# EAGLE design USBPowerBoost_SMD_v0_1_6 (EAGLE 5.11)
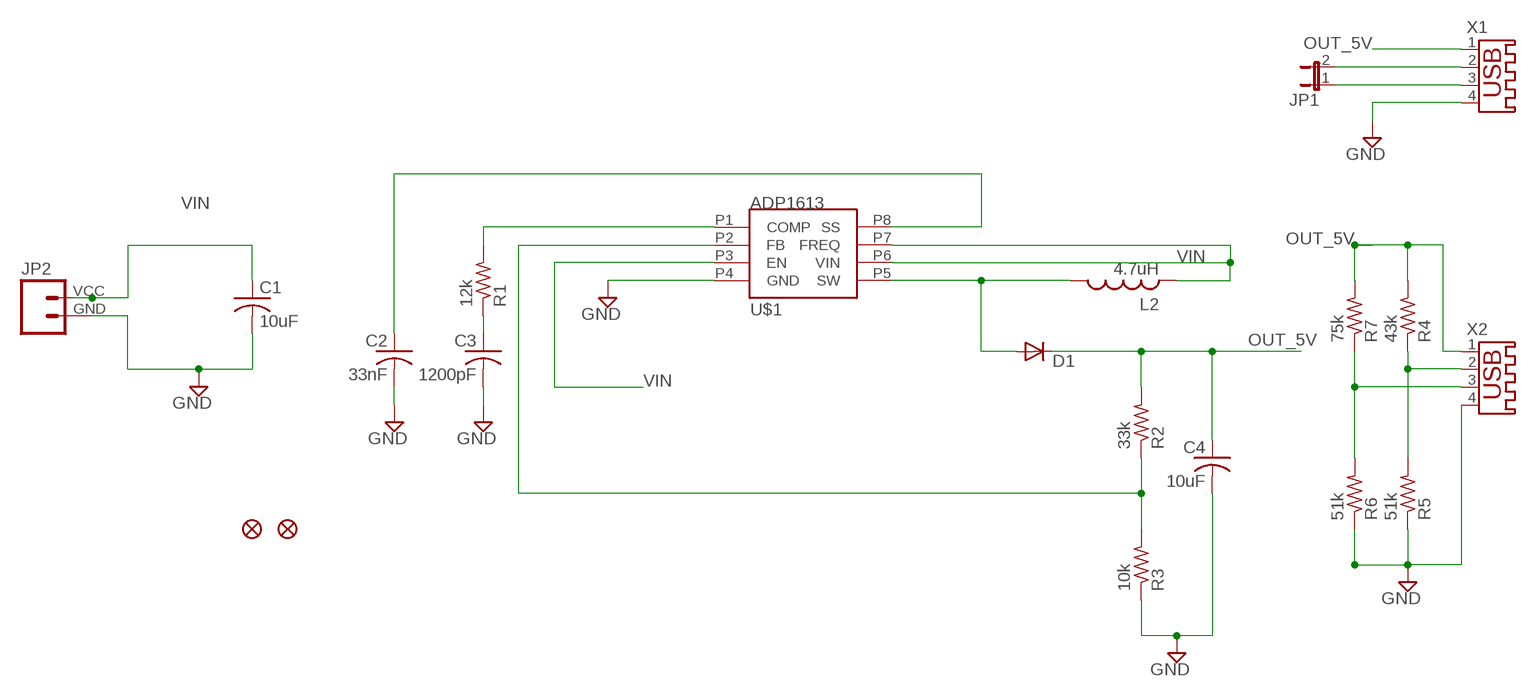
[diagram p0: schematic, sheet 1]

## Parts
C1  10uF  C-USC1206  [C1206]
C2  33nF  C-USC0603  [C0603]
C3  1200pF  C-USC0603  [C0603]
C4  10uF  C-USC1206  [C1206]
D1  DIODE-DO-214AC  [DO-214AC]
FIDUCIAL1  FIDUCIAL1X2  [FIDUCIAL-1X2]
FIDUCIAL2  FIDUCIAL1X2  [FIDUCIAL-1X2]
JP1  JUMPER-2PTH  [1X02]
JP2  M024UCON-15767  [JST-2-SMD-VERT]
L2  4.7uH  L-VLC5045  [VLC5045]
R1  12k  R-US_R0603  [R0603]
R2  33k  R-US_R0603  [R0603]
R3  10k  R-US_R0603  [R0603]
R4  43k  R-US_R0603  [R0603]
R5  51k  R-US_R0603  [R0603]
R6  51k  R-US_R0603  [R0603]
R7  75k  R-US_R0603  [R0603]
U$1  ADP1613  [RM-8]
X1  USB-A003  [USB-A003]
X2  USB-A003  [USB-A003]

## Nets
5V: D1.A L2.P$2 U$1.P5(SW)
GND: C1.2 C2.2 C3.2 C4.2 JP2.GND R3.1 R5.1 R6.1 U$1.P4(GND) X1.4 X2.4
N$2: R2.1 R3.2 U$1.P2(FB)
N$3: R4.1 R5.2 X2.2
N$5: R1.2 U$1.P1(COMP)
N$7: C3.1 R1.1
N$8: JP1.2 X1.2
N$9: JP1.1 X1.3
N$11: C2.1 U$1.P8(SS)
N$15: R6.2 R7.1 X2.3
OUT_5V: C4.1 D1.C R2.2 R4.2 R7.2 X1.1 X2.1
VIN: C1.1 JP2.VCC L2.P$1 U$1.P3(EN) U$1.P6(VIN) U$1.P7(FREQ)

## Library data of the parts
C1-C4 = rcl:C-US: CAPACITOR, American symbol
D1 = diode:DIODE-: DIODE
FIDUCIAL1 FIDUCIAL2 = SparkFun:FIDUCIAL: Fiducial Alignment Points Various fiducial points for machine vision alignment.
JP1 = SparkFun:JUMPER-2: Jumper Basic 0.1" spaced jumper. Use with breakaway headers.
JP2 = SparkFun:M02: Header 2 Standard 2-pin 0.1" header. Use with straight break away headers (SKU : PRT-00116), right angle break away headers (PRT-00553), swiss pins (PRT-00743), machine pins (PRT-00117), and female headers (PRT-00115). Molex polarized connector foot print use with SKU : PRT-08233 with associated crimp pins and housings.
L2 = bootstrapsolar:L-VLC5045: VLC5045 Series inductor. SMD.
R1-R7 = resistor:R-US_: RESISTOR, American symbol
U$1 = adp1613:ADP1613
X1 X2 = con-yamaichi:USB-A003: USB connector; OC_FARNELL: unknown; OC_NEWARK: unknown

## Board
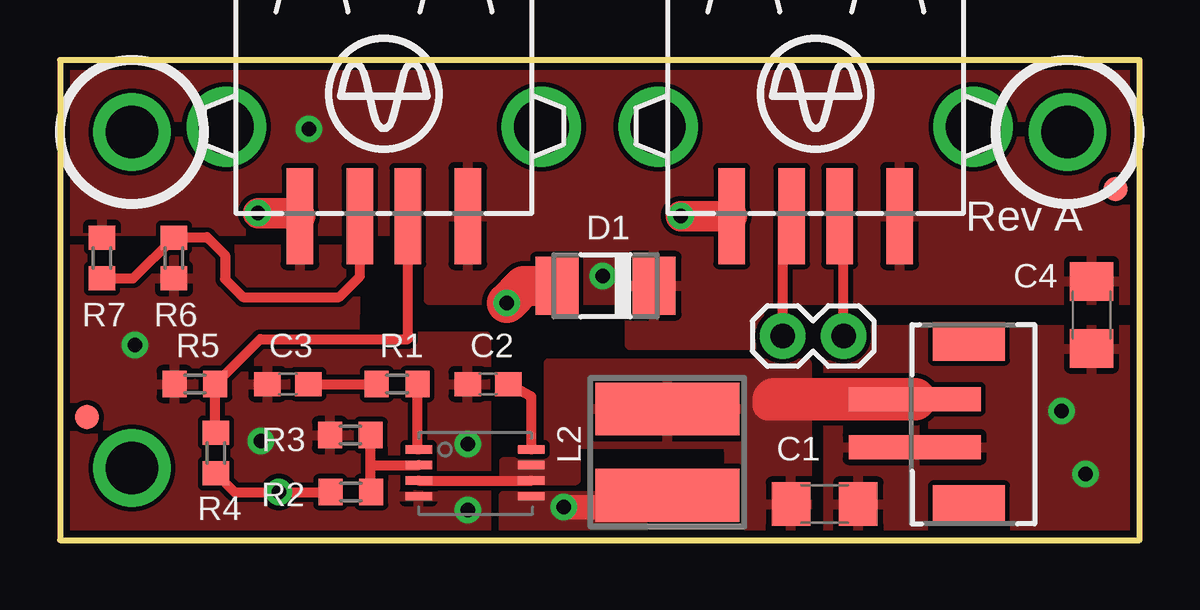
[diagram p1: board, top side]
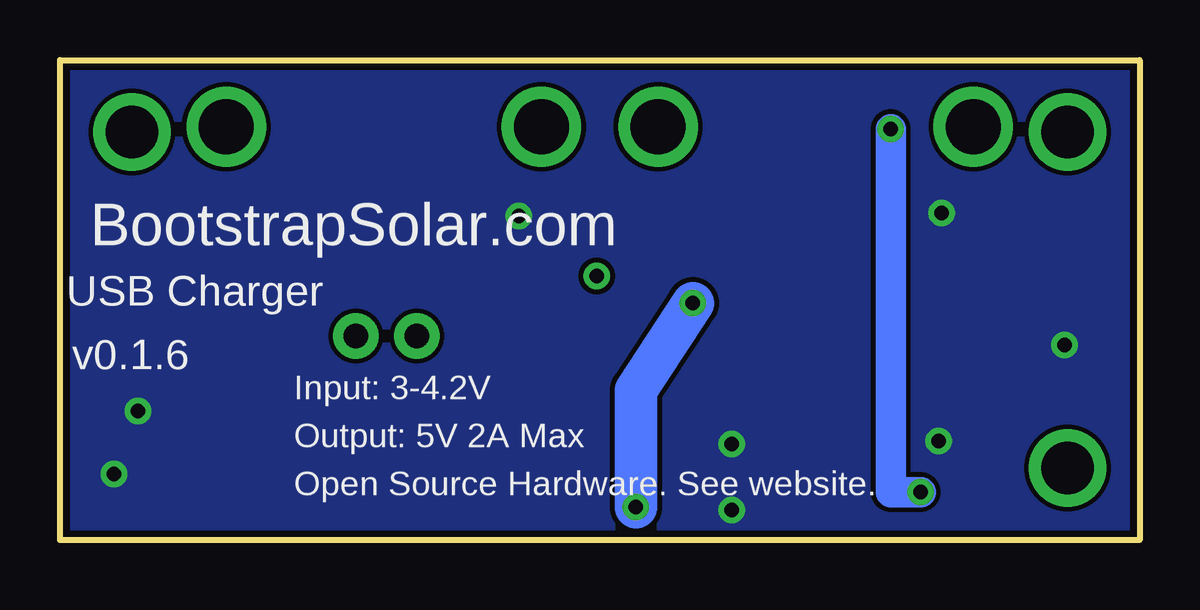
[diagram p2: board, bottom side, seen from below]

Size 45 x 20 mm. Coordinates in mm from the lower left corner, seen from the top.
Outline: 0,0 45,0 45,20 0,20 0,0
Copper layers (1*16): Top 0.035mm / dielectric 1.5mm / Bottom 0.035mm
Design rules "SparkFun *": minimum track width 8mil, minimum drill 20mil, track to track 8mil, track to pad 8mil, pad to pad 8mil, via to via 8mil, smd to smd 8mil, copper to edge 11mil, drill to drill 8mil, minimum pad ring 12mil, minimum via ring 10mil, stop-mask expansion 4mil, vias tented up to drill 25mil, thermal gap 10mil

### Footprints (pad centres in the part's own frame; a part is rotated, then mirrored left to right if it is on the bottom)
C1206 = smd 1.6 x 1.8: 1 -1.4,0; 2 1.4,0
C0603 = smd 1.1 x 1: 1 -0.85,0; 2 0.85,0
DO-214AC = smd 1.8 x 2.4: A 2.025,0; C -2.025,0
FIDUCIAL-1X2 = smd 1 x 1: 1 0,0
1X02 = drill 1.016 pad 1.88 round: 1 0,0; 2 2.54,0
JST-2-SMD-VERT = smd 1 x 5.5: GND 1,-2; VCC -1,-2 | smd 1.6 x 3: P$1 -3.4,0.27; P$2 3.4,0.27
VLC5045 = smd 2.2 x 6: P$1 -1.8,0; P$2 1.8,0
R0603 = smd 1 x 1.1: 1 -0.85,0; 2 0.85,0
RM-8 = smd 1.1 x 0.35: P1 -4.7,0.7; P2 -4.7,0.05; P3 -4.7,-0.6; P4 -4.7,-1.25; P5 0,-1.25; P6 0,-0.6; P7 0,0.05; P8 0,0.7
USB-A003 = smd 1.12 x 4: 1 -3.5,14; 2 -1,14; 3 1,14; 4 3.5,14 | drill 2.3 round: P$1 -6.57,10.28; P$2 6.57,10.28

### Placement (x,y rotation side)
C1  31.88,1.5 0 top
C2  17.84,6.5 180 top
C3  9.5,6.5 180 top
C4  43,9.38 270 top
D1  22.74,10.59 180 top
FIDUCIAL1  1.12,5.12 0 top
FIDUCIAL2  44,14.62 0 top
JP1  30.12,8.5 0 top
JP2  37.62,4.88 270 top
L2  25.32,3.66 270 top
R1  14.05,6.5 0 top
R2  12.12,2 180 top
R3  12.1,4.38 0 top
R4  6.5,3.62 270 top
R5  5.62,6.5 0 top
R6  4.75,11.75 90 top
R7  1.75,11.75 90 top
U$1  19.65,3.08 0 top
X1  31.5,27.5 180 top
X2  13.5,27.5 180 top

### Tracks (layer width: path | path; a pad name or v marks a point on that pad's centre or on a via)
5V  (via drill 0.6)
  Top 1.016: L2.P$2 24.11,1.86 23.62,1.38 v21,1.38
  Top 1.676: D1.A 19.34,10.59 v18.62,9.88
  Bottom 1.778: v18.62,9.88 21,6.25 v21,1.38
  pour Top (no thermals): 18.5,1.85 24.25,1.85 24.25,-0.12 18.5,-0.12
GND  (via drill 0.6)
  Top 1.27: v25.88,13.5 X1.4 | v8.25,13.62 9.88,13.62 X2.4
  other vias: 8.38,4.12 17,4 17,1.25 42.75,2.75 41.75,5.38 3.12,8.12
  pour Bottom: -0.1,20.3 45,20.3 45,-0.2 -0.1,-0.2
  pour Top: 0.38,12.12 12.38,12.12 12.25,8.5 17.75,8.5 17.75,0.25 0.25,0.25
  pour Top: 45.38,8.75 32,8.75 32,-0.25 45.38,-0.25
N$1  (via drill 2.2 pad 2.18)
  other vias: 3,17
N$2
  Top 0.406: 12.95,3.12 12.95,2.02 R2.1 | 12.95,3.12 R3.2 | 12.95,3.12 U$1.P2
N$3
  Top 0.406: R4.1 6.47,4.47 R5.2 8.35,8.38 14.5,8.38 X2.2
N$4  (via drill 2.2)
  other vias: 3,3
N$5
  Top 0.406: U$1.P1 14.9,3.77 R1.2
N$7
  Top 0.406: C3.1 R1.1
N$8
  Top 0.406: X1.2 32.66,13.5 JP1.2
N$9
  Top 0.406: X1.3 30.12,13.5 JP1.1
N$11
  Top 0.406: U$1.P8 19.65,5.97 C2.1
N$15
  Top 0.406: R7.1 3.05,10.9 R6.2 4.78,12.62 6.12,12.62 6.88,11.88 6.88,10.88 7.62,10.12 11.62,10.12 12.5,11 X2.3
N$20  (via drill 2.2 pad 2.18)
  other vias: 42,17
OUT_5V  (via drill 0.6)
  Top 0.406: R4.2 7.28,2 v9.12,2 R2.2
  Bottom 1.27: v9.12,2 10.38,2 v10.38,17.12
  other vias: 22.62,11
  pour Top: 46,10 15.38,10 15.38,12.88 -0.5,12.88 -0.5,21 46,21
  pour Top: 23.75,12.25 29.12,12.25 29.12,8.12 23.75,8.12
VIN
  Top 0.406: U$1.P3 U$1.P6
  Top 1.27: 29.75,5.88 29.5,5.62
  Top 1.778: 29.75,5.88 JP2.VCC
  pour Top (no thermals): 18.5,2.5 21.5,2.5 21.5,6.25 20.5,6.25 20.5,3.25 18.5,3.25
  pour Top: 20.38,7.38 31.12,7.38 31.12,0 28,0 27.88,4 20.38,4

### Text on the board
tNames: Rev A
bNames: BootstrapSolar.com | USB Charger | v0.1.6 | Input: 3-4.2V | Output: 5V 2A Max | Open Source Hardware. See website.